# EAGLE design Smart-home (EAGLE 8.6.1)
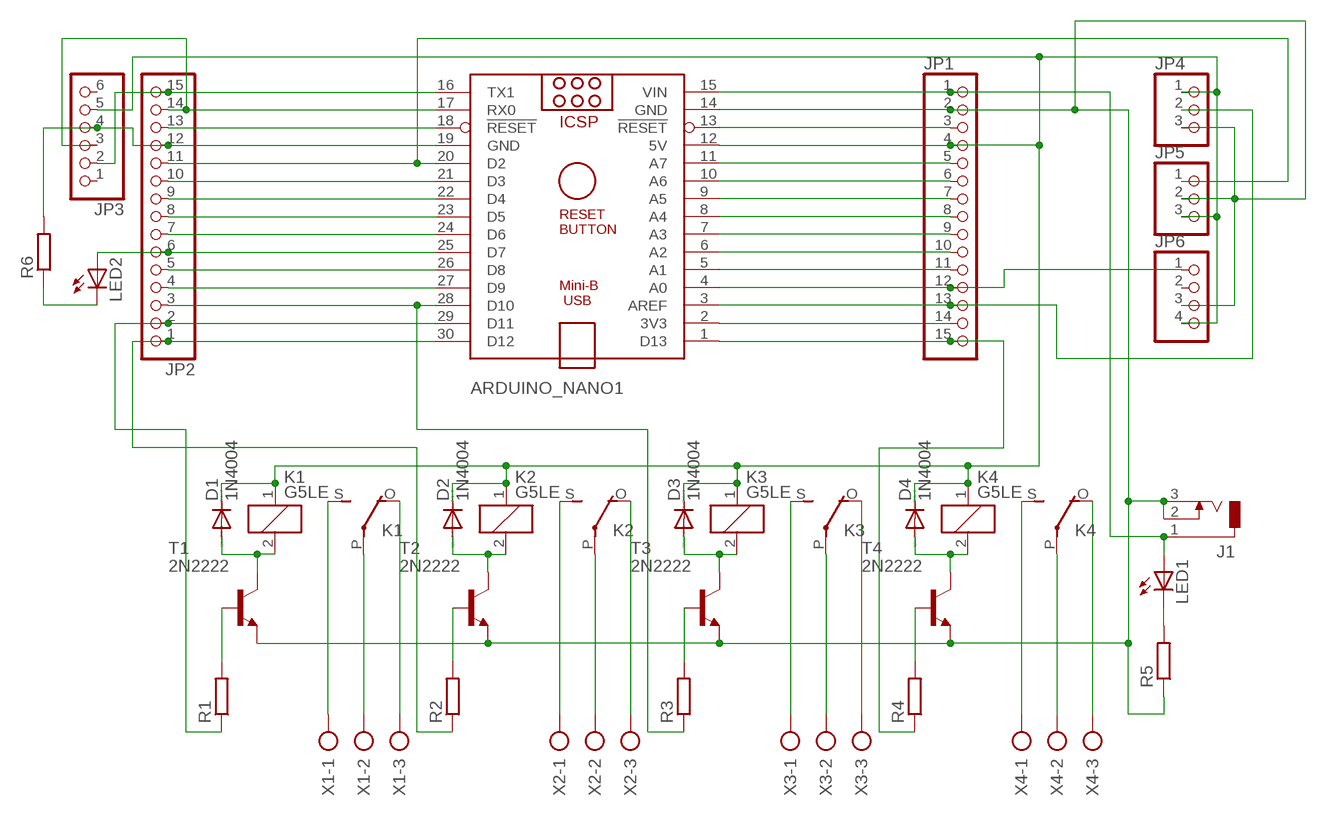
[diagram p0: schematic, sheet 1]

## Parts
ARDUINO_NANO1  ARDUINO_NANO  [ARDUINO_NANO]
D1  1N4004  [DO41-10]
D2  1N4004  [DO41-10]
D3  1N4004  [DO41-10]
D4  1N4004  [DO41-10]
J1  DCJ0303  [DCJ0303]
JP1  PINHD-1X15  [1X15]
JP2  PINHD-1X15  [1X15]
JP3  PINHD-1X6  [1X06]
JP4  PINHD-1X3  [1X03]
JP5  PINHD-1X3  [1X03]
JP6  PINHD-1X4  [1X04]
K1  G5LE  [G5LE]
K2  G5LE  [G5LE]
K3  G5LE  [G5LE]
K4  G5LE  [G5LE]
LED1  LED3MM  [LED3MM]
LED2  LED3MM  [LED3MM]
R1  R-EU_0204/7  [0204/7]
R2  R-EU_0204/7  [0204/7]
R3  R-EU_0204/7  [0204/7]
R4  R-EU_0204/7  [0204/7]
R5  R-EU_0204/7  [0204/7]
R6  R-EU_0204/7  [0204/7]
T1  2N2222  [TO18]
T2  2N2222  [TO18]
T3  2N2222  [TO18]
T4  2N2222  [TO18]
X1  AK300/3  [AK300/3]
X2  AK300/3  [AK300/3]
X3  AK300/3  [AK300/3]
X4  AK300/3  [AK300/3]

## Nets
N$1: D1.A K1.2 T1.3(C)
N$2: ARDUINO_NANO1.17(RX0) JP2.14 JP3.3
N$3: D2.A K2.2 T2.3(C)
N$4: D3.A K3.2 T3.3(C)
N$5: D4.A K4.2 T4.3(C)
N$6: ARDUINO_NANO1.30(D12) JP2.1 R2.1
N$7: R1.2 T1.2(B)
N$8: ARDUINO_NANO1.1(D13) JP1.15 R4.1
N$9: ARDUINO_NANO1.28(D10) JP2.3 R3.1
N$10: ARDUINO_NANO1.16(TX1) JP2.15 JP3.2
N$11: ARDUINO_NANO1.14(GND) J1.2 J1.3 JP1.2 JP4.3 JP5.2 JP6.3 R5.1 T1.1(E) T2.1(E) T3.1(E) T4.1(E)
N$12: ARDUINO_NANO1.18(!RESET) JP2.13
N$13: ARDUINO_NANO1.19(GND) JP2.12 JP3.4 R6.2
N$14: ARDUINO_NANO1.20(D2) JP2.11 JP5.1
N$15: ARDUINO_NANO1.21(D3) JP2.10
N$16: ARDUINO_NANO1.22(D4) JP2.9
N$17: ARDUINO_NANO1.23(D5) JP2.8
N$18: ARDUINO_NANO1.24(D6) JP2.7
N$19: ARDUINO_NANO1.25(D7) JP2.6 LED2.A
N$20: ARDUINO_NANO1.26(D8) JP2.5
N$21: ARDUINO_NANO1.27(D9) JP2.4
N$23: ARDUINO_NANO1.3(AREF) JP1.13 JP4.2
N$24: ARDUINO_NANO1.11(A7) JP1.5
N$25: ARDUINO_NANO1.5(A1) JP1.11
N$26: ARDUINO_NANO1.6(A2) JP1.10
N$27: ARDUINO_NANO1.7(A3) JP1.9
N$28: ARDUINO_NANO1.8(A4) JP1.8
N$29: ARDUINO_NANO1.9(A5) JP1.7
N$30: ARDUINO_NANO1.10(A6) JP1.6
N$31: LED2.K(C) R6.1
N$32: K1.O(2:O) X1.3
N$33: ARDUINO_NANO1.13(!RESET) JP1.3
N$34: ARDUINO_NANO1.2(3V3) JP1.14
N$35: ARDUINO_NANO1.4(A0) JP1.12 JP6.1
N$36: K1.P(2:P) X1.2
N$37: ARDUINO_NANO1.12(5V) D1.C D2.C D3.C D4.C JP1.4 JP3.5 JP4.1 JP5.3 JP6.4 K1.1 K2.1 K3.1 K4.1
N$38: K1.S(2:S) X1.1
N$39: K2.S(2:S) X2.1
N$40: K2.P(2:P) X2.2
N$41: K2.O(2:O) X2.3
N$42: K3.P(2:P) X3.2
N$43: K3.O(2:O) X3.3
N$44: K3.S(2:S) X3.1
N$45: K4.S(2:S) X4.1
N$46: K4.P(2:P) X4.2
N$47: K4.O(2:O) X4.3
N$48: ARDUINO_NANO1.29(D11) JP2.2 R1.1
N$49: R2.2 T2.2(B)
N$50: R3.2 T3.2(B)
N$51: R4.2 T4.2(B)
N$52: ARDUINO_NANO1.15(VIN) J1.1 JP1.1 LED1.A
N$54: LED1.K(C) R5.2
Unconnected: JP3.1 JP3.6 JP6.2

## Library data of the parts
ARDUINO_NANO1 = ArduinoNanoV30:ARDUINO_NANO: Arduino Nano V3.0 Overview: The Arduino Nano is a small, complete, and breadboard-friendly board based on the ATmega328 (Arduino Nano 3.x) or ATmega168 (Arduino Nano 2.x). It has more or less the same functionality of the Arduino Duemilanove, but in a different package. It lacks only a DC power jack, and works with a Mini-B USB cable instead of a standard one. The Nano was designed and is being produced by Gravitech. Specifications: Microcontroller Atmel ATmega168 or ATmega328 Operating Voltage (logic level) 5 V Input Voltage (recommended) 7-12 V Input Voltage (limits) 6-20 V Digital I/O Pins 14 (of which 6 provide PWM output) Analog Input Pins 8 DC Current per I/O Pin 40 mA Flash Memory 16 KB (ATmega168) or 32 KB (ATmega328) of which 2 KB used by bootloader SRAM 1 KB (ATmega168) or 2 KB (ATmega328) EEPROM 512 bytes (ATmega168) or 1 KB (ATmega328) Clock Speed 16 MHz Dimensions 0.73" x 1.70" Length 45 mm Width 18 mm Weigth 5 g Power: The Arduino Nano can be powered via the Mini-B USB connection, 6-20V unregulated external power supply (pin 30), or 5V regulated external power supply (pin 27). The power source is automatically selected to the highest voltage source. Memory: The ATmega168 has 16 KB of flash memory for storing code (of which 2 KB is used for the bootloader); the ATmega328 has 32 KB, (also with 2 KB used for the bootloader). The ATmega168 has 1 KB of SRAM and 512 bytes of EEPROM (which can be read and written with the EEPROM library); the ATmega328 has 2 KB of SRAM and 1 KB of EEPROM. Input and Output: Each of the 14 digital pins on the Nano can be used as an input or output, using pinMode(), digitalWrite(), and digitalRead() functions. They operate at 5 volts. Each pin can provide or receive a maximum of 40 mA and has an internal pull-up resistor (disconnected by default) of 20-50 kOhms. In addition, some pins have specialized functions. Visit Arduino - ArduinoBoardNano <https://www.arduino.cc/en/Main/ArduinoBoardNano>
D1-D4 = diode:1N4004: DIODE general purpose rectifier, 1 A
J1 = con-jack:DCJ0303: DC POWER JACK Source: DCJ0303.pdf; OC_FARNELL: unknown; OC_NEWARK: unknown
JP1 JP2 = pinhead:PINHD-1X15: PIN HEADER
JP3 = pinhead:PINHD-1X6: PIN HEADER
JP4 JP5 = pinhead:PINHD-1X3: PIN HEADER
JP6 = pinhead:PINHD-1X4: PIN HEADER
K1-K4 = relay:G5LE: RELAY 1 x switch, 10 A/120 V AC, 8 A/30 V DC, Omron; OC_FARNELL: unknown; OC_NEWARK: unknown
LED1 LED2 = led:LED: LED OSRAM: - CHIPLED LG R971, LG N971, LY N971, LG Q971, LY Q971, LO R971, LY R971 LH N974, LH R974 LS Q976, LO Q976, LY Q976 LO Q996 - Hyper CHIPLED LW Q18S LB Q993, LB Q99A, LB R99A - SideLED LS A670, LO A670, LY A670, LG A670, LP A670 LB A673, LV A673, LT A673, LW A673 LH A674 LY A675 LS A676, LA A676, LO A676, LY A676, LW A676 LS A679, LY A679, LG A679 - Hyper Micro SIDELED® LS Y876, LA Y876, LO Y876, LY Y876 LT Y87S - SmartLED LW L88C, LW L88S LB L89C, LB L89S, LG L890 LS L89K, LO L89K, LY L89K LS L896, LA L896, LO L896, LY L896 - TOPLED LS T670, LO T670, LY T670, LG T670, LP T670 LSG T670, LSP T670, LSY T670, LOP T670, LYG T670 LG T671, LOG T671, LSG T671 LB T673, LV T673, LT T673, LW T673 LH T674 LS T676, LA T676, LO T676, LY T676, LB T676, LH T676, LSB T676, LW T676 LB T67C, LV T67C, LT T67C, LS T67K, LO T67K, LY T67K, LW E67C LS E67B, LA E67B, LO E67B, LY E67B, LB E67C, LV E67C, LT E67C LW T67C LS T679, LY T679, LG T679 LS T770, LO T770, LY T770, LG T770, LP T770 LB T773, LV T773, LT T773, LW T773 LH T774 LS E675, LA E675, LY E675, LS T675 LS T776, LA T776, LO T776, LY T776, LB T776 LHGB T686 LT T68C, LB T68C - Hyper Mini TOPLED® LB M676 - Mini TOPLED Santana® LG M470 LS M47K, LO M47K, LY M47K Source: http://www.osram.convergy.de LUXEON: - LUMILED® LXK2-PW12-R00, LXK2-PW12-S00, LXK2-PW14-U00, LXK2-PW14-V00 LXK2-PM12-R00, LXK2-PM12-S00, LXK2-PM14-U00 LXK2-PE12-Q00, LXK2-PE12-R00, LXK2-PE12-S00, LXK2-PE14-T00, LXK2-PE14-U00 LXK2-PB12-K00, LXK2-PB12-L00, LXK2-PB12-M00, LXK2-PB14-N00, LXK2-PB14-P00, LXK2-PB14-Q00 LXK2-PR12-L00, LXK2-PR12-M00, LXK2-PR14-Q00, LXK2-PR14-R00 LXK2-PD12-Q00, LXK2-PD12-R00, LXK2-PD12-S00 LXK2-PH12-R00, LXK2-PH12-S00 LXK2-PL12-P00, LXK2-PL12-Q00, LXK2-PL12-R00 Source: www.luxeon.com KINGBRIGHT: KA-3528ASYC Source: www.kingbright.com
R1-R6 = rcl:R-EU_: RESISTOR, European symbol; SPICEPREFIX: R
T1-T4 = transistor:2N2222: NPN TRANSISTOR
X1-X4 = con-ptr500:AK300/3: CONNECTOR; OC_FARNELL: unknown; OC_NEWARK: unknown

## Board
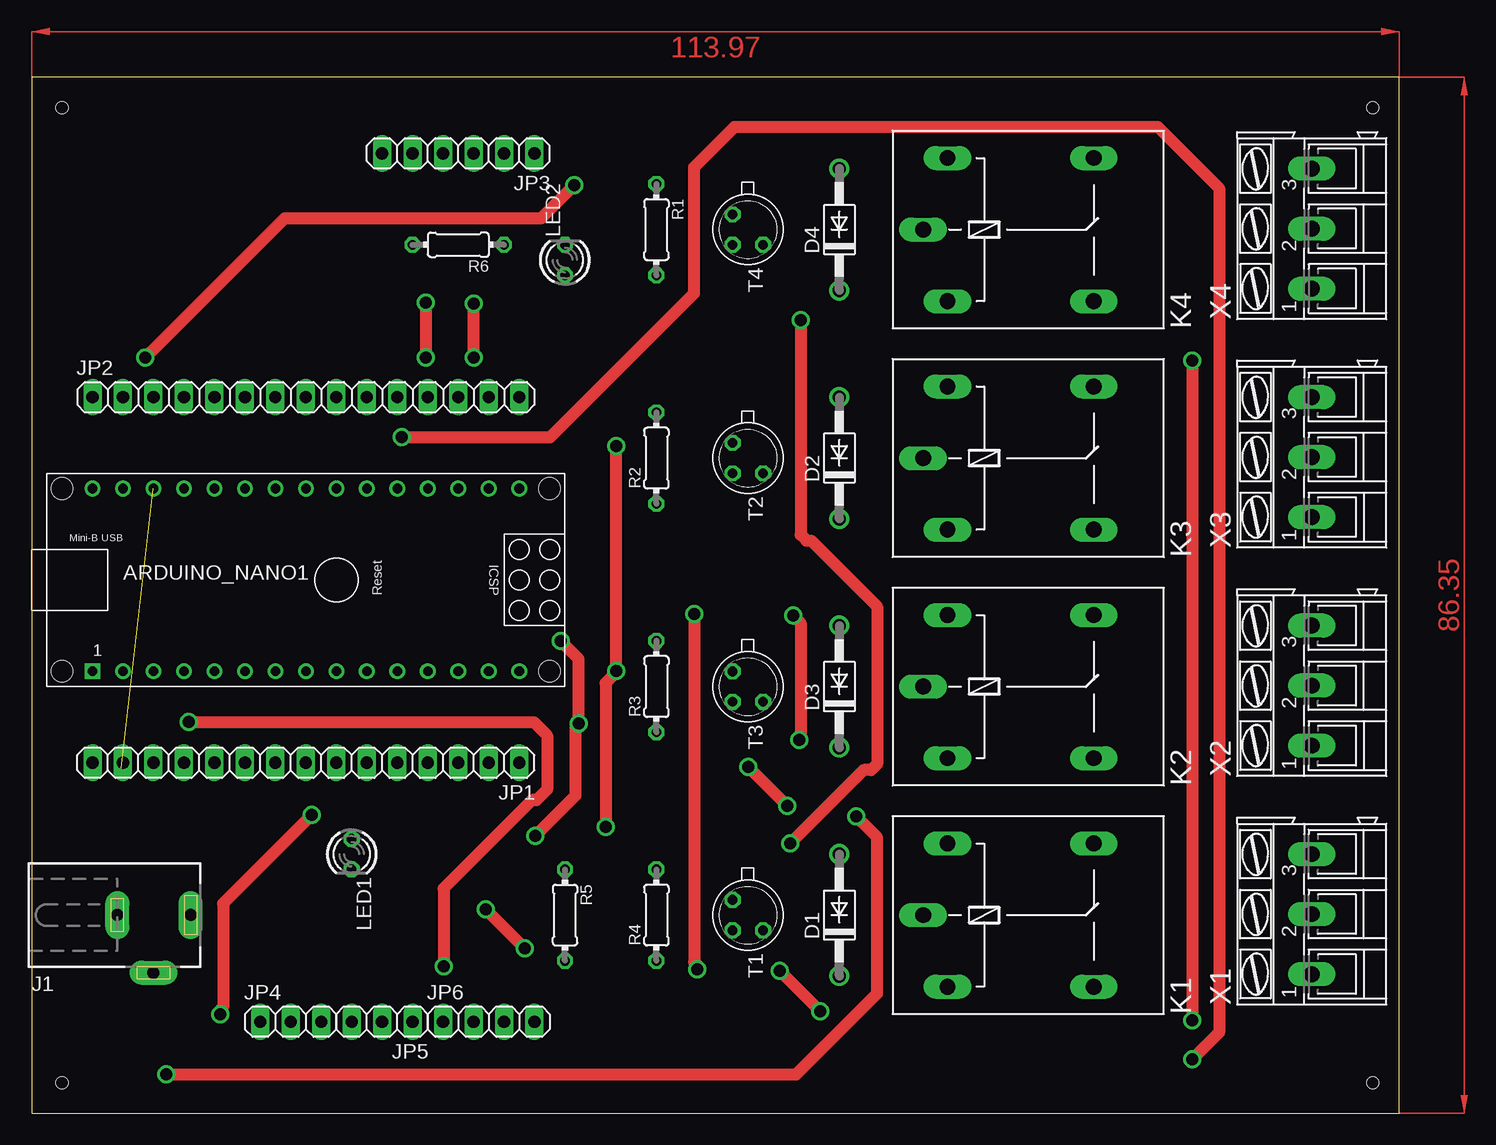
[diagram p1: board, top side]
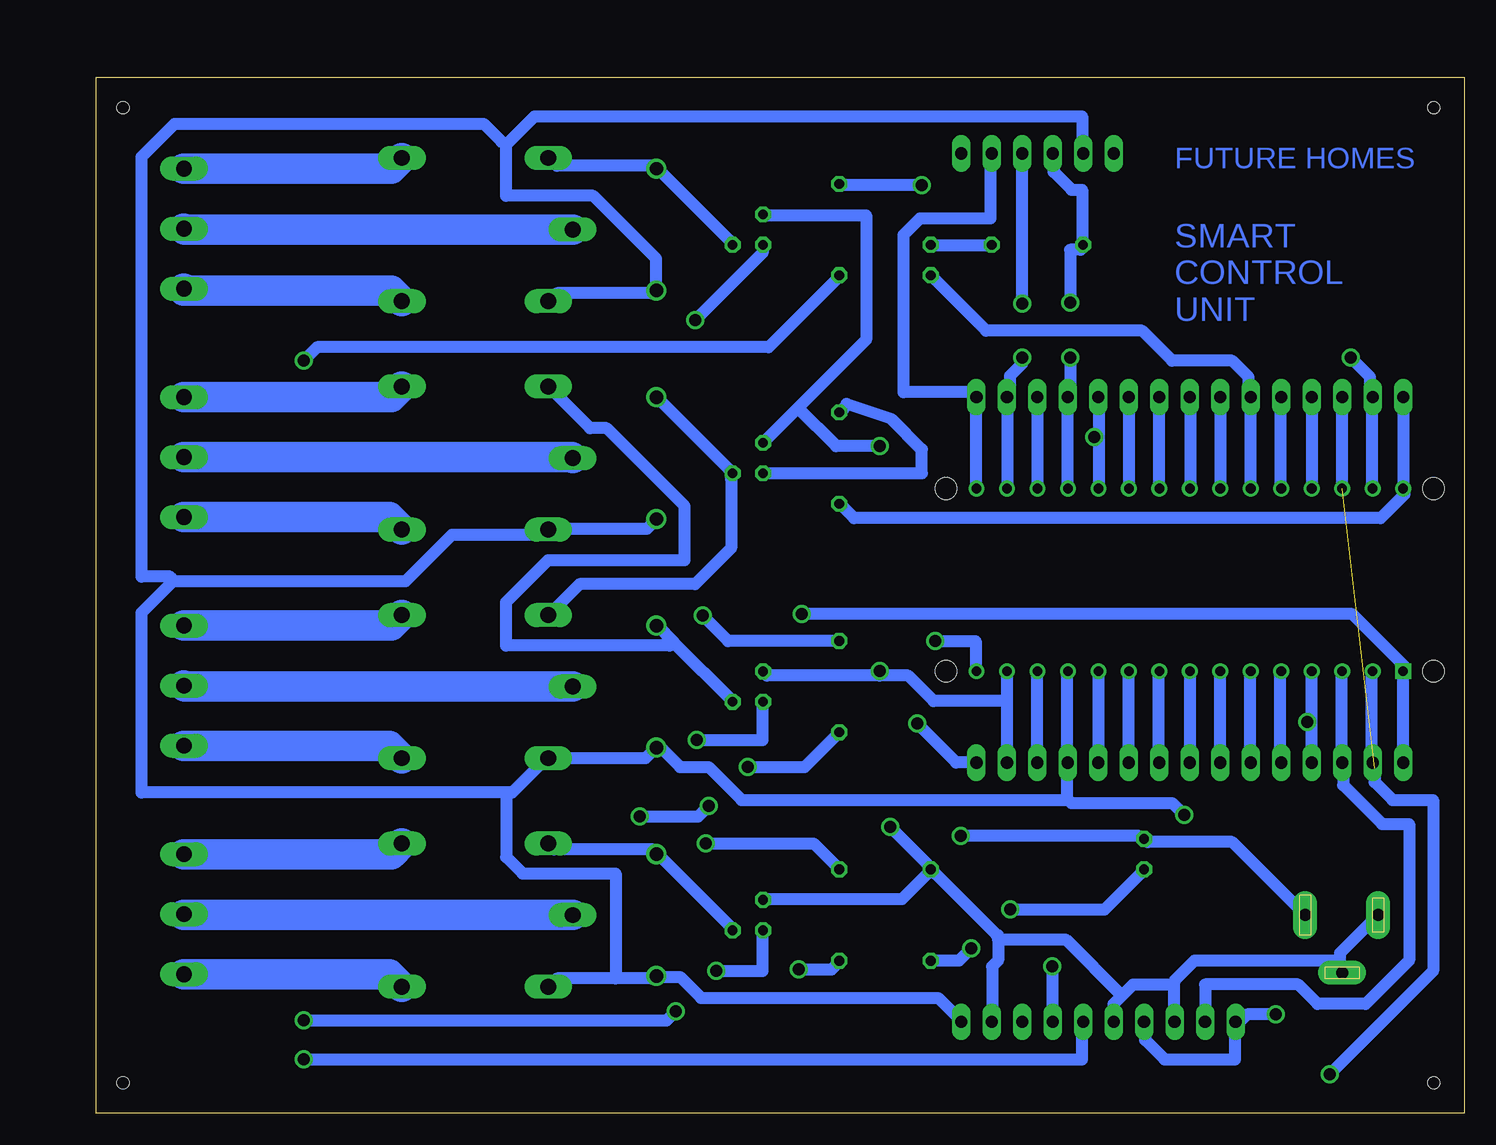
[diagram p2: board, bottom side, seen from below]

Size 113.97 x 86.35 mm. Coordinates in mm from the lower left corner, seen from the top.
Outline: 0,0 113.97,0 113.97,86.35 0,86.35 0,0
Copper layers (1*16): Top 0.035mm / dielectric 1.5mm / Bottom 0.035mm
Design rules "default *": minimum track width 1mm, minimum drill 1mm, track to track 1mm, track to pad 1mm, pad to pad 1mm, via to via 1mm, smd to smd 1mm, copper to edge 40mil, drill to drill 15mil, minimum pad ring 10mil, minimum via ring 8mil, stop-mask expansion 4mil, vias tented up to drill 0mil, thermal gap 10mil
Holes 1 mm at 2.54,2.54 111.76,2.54 111.76,83.82 2.54,83.82
tRestrict: area 26.7,77.5 to 44.5,82.5; area 16.5,3.8 to 44.5,11.4; area 5.1,8.9 to 15.2,22.9; area 24.1,17.8 to 29.2,25.4; area 41.9,11.4 to 54.6,21.6; area 55.9,12.7 to 63.5,21.6; area 64.8,10.2 to 69.8,22.9; area 71.1,8.9 to 94,24.1; area 71.1,27.9 to 94,43.2; area 71.1,47 to 94,62.2; area 71.1,66 to 94,81.3; area 100.3,66 to 113,81.3; 18 more areas

### Footprints (pad centres in the part's own frame; a part is rotated, then mirrored left to right if it is on the bottom)
ARDUINO_NANO = drill 0.8 square: 1 -20.32,-7.62 | drill 0.8: 2 -17.78,-7.62; 3 -15.24,-7.62; 4 -12.7,-7.62; 5 -10.16,-7.62; 6 -7.62,-7.62; 7 -5.08,-7.62; 8 -2.54,-7.62; 9 0,-7.62; 10 2.54,-7.62; 11 5.08,-7.62; 12 7.62,-7.62; 13 10.16,-7.62; 14 12.7,-7.62; 15 15.24,-7.62; 16 15.24,7.62; 17 12.7,7.62; 18 10.16,7.62; 19 7.62,7.62; 20 5.08,7.62; 21 2.54,7.62; 22 0,7.62; 23 -2.54,7.62; 24 -5.08,7.62; 25 -7.62,7.62; 26 -10.16,7.62; 27 -12.7,7.62; 28 -15.24,7.62; 29 -17.78,7.62; 30 -20.32,7.62 | hole 1.778: -22.86,-7.62; -22.86,7.62; 17.78,7.62; 17.78,-7.62
DO41-10 = drill 1.118: A 5.08,0; C -5.08,0
DCJ0303 = drill 1 pad 2 long: 1 0,3.1; 2 4.8,0; 3 0,-3
1X15 = drill 1.016 long: 1 -17.78,0; 2 -15.24,0; 3 -12.7,0; 4 -10.16,0; 5 -7.62,0; 6 -5.08,0; 7 -2.54,0; 8 0,0; 9 2.54,0; 10 5.08,0; 11 7.62,0; 12 10.16,0; 13 12.7,0; 14 15.24,0; 15 17.78,0
1X06 = drill 1.016 long: 1 -6.35,0; 2 -3.81,0; 3 -1.27,0; 4 1.27,0; 5 3.81,0; 6 6.35,0
1X03 = drill 1.016 long: 1 -2.54,0; 2 0,0; 3 2.54,0
1X04 = drill 1.016 long: 1 -3.81,0; 2 -1.27,0; 3 1.27,0; 4 3.81,0
G5LE = drill 1.321 long: 1 -7.493,-5.969; 2 -7.493,5.969; O 4.699,5.969; P -9.525,0; S 4.699,-5.969
LED3MM = drill 0.813 octagon: A -1.27,0; K 1.27,0
0204/7 = drill 0.813 octagon: 1 -3.81,0; 2 3.81,0
TO18 = drill 0.813 octagon: 1 -1.27,-1.27; 2 1.27,-1.27; 3 1.27,1.27
AK300/3 = drill 1.321 long: 1 -5.004,0; 2 0,0; 3 5.004,0

### Placement (x,y rotation side)
ARDUINO_NANO1  25.4,44.45 0 top
D1  67.31,16.51 90 top
D2  67.31,54.61 90 top
D3  67.31,35.56 90 top
D4  67.31,73.66 90 top
J1  10.16,16.51 270 top
JP1  22.86,29.21 180 top
JP2  22.86,59.69 0 top
JP3  35.56,80.01 180 top
JP4  21.59,7.62 0 top
JP5  29.21,7.62 180 top
JP6  38.1,7.62 0 top
K1  83.82,16.51 0 top
K2  83.82,35.56 0 top
K3  83.82,54.61 0 top
K4  83.82,73.66 0 top
LED1  26.67,21.59 270 top
LED2  44.45,71.12 90 top
R1  52.07,73.66 270 top
R2  52.07,54.61 90 top
R3  52.07,35.56 90 top
R4  52.07,16.51 90 top
R5  44.45,16.51 270 top
R6  35.56,72.39 180 top
T1  59.69,16.51 270 top
T2  59.69,54.61 270 top
T3  59.69,35.56 270 top
T4  59.69,73.66 270 top
X1  106.68,16.59 90 top
X2  106.68,35.64 90 top
X3  106.68,54.69 90 top
X4  106.68,73.74 90 top

### Tracks (layer width: path | path; a pad name or v marks a point on that pad's centre or on a via)
N$1
  Bottom 1: T1.3 60.96,15.36 67.08,21.48 67.21,21.48 D1.A 67.58,21.98 75.83,21.98 76.21,22.36 K1.2
N$2  (via drill 1)
  Top 1: v36.84,62.98 v36.84,67.48
  Bottom 1: ARDUINO_NANO1.17 38.09,52.1 38.09,59.6 JP2.14 37.84,60.1 37.84,61.48 36.84,62.48 v36.84,62.98 | v36.84,67.48 36.84,79.98 JP3.3
N$3
  Bottom 1: D2.A 67.21,59.6 60.96,53.35 T2.3 61.09,52.85 61.09,47.1 64.08,44.1 73.71,44.1 76.21,41.6 K2.2
N$4
  Bottom 1: 65.9,39.29 67.21,40.6 D3.A | 65.9,39.29 60.96,34.35 T3.3 | K3.2 76.21,60.48 72.83,57.1 71.46,57.1 64.96,50.6 64.96,46.1 76.33,46.1 79.83,42.6 79.83,38.98 66.21,38.98 65.9,39.29
N$5
  Bottom 1: T4.3 60.96,72.48 67.21,78.73 D4.A 67.71,78.98 75.58,78.98 76.21,79.61 K4.2
N$6
  Bottom 1: JP2.1 5.08,59.6 5.08,52.1 ARDUINO_NANO1.30 4.96,51.6 6.96,49.6 50.84,49.6 51.96,50.73 R2.1
N$7  (via drill 1)
  Top 1: v65.71,8.48 v62.34,11.86 | v96.71,62.73 v96.71,7.73
  Bottom 1: v62.34,11.86 58.46,11.86 58.46,15.23 T1.2 | v65.71,8.48 66.46,7.73 v96.71,7.73 | v96.71,62.73 95.58,63.85 57.96,63.85 52.09,69.73 R1.2
N$8  (via drill 1)
  Top 1: v55.46,11.98 55.46,12.36 55.21,12.61 v55.21,41.6
  Bottom 1: JP1.15 5.08,29.23 5.08,36.73 ARDUINO_NANO1.1 4.96,37.23 9.34,41.6 v55.21,41.6 | v55.46,11.98 52.71,11.98 52.09,12.61 R4.1
N$9  (via drill 1)  (1 unrouted)
  Top 1: v62.96,25.61 v59.71,28.86 | v68.71,24.73 70.46,22.98 70.46,9.98 63.71,3.23 v11.21,3.23
  Bottom 1: v59.71,28.86 54.96,28.86 52.09,31.73 R3.1 | v62.96,25.61 63.84,24.73 v68.71,24.73 | v11.21,3.23 2.58,11.86 2.58,26.11 5.96,26.11 7.46,27.61 7.46,28.73 | ARDUINO_NANO1.28 10.21,52.1 10.21,59.6 JP2.3
N$10
  Bottom 1: ARDUINO_NANO1.16 40.71,52.1 40.71,59.6 JP2.15 40.84,60.1 46.71,60.1 46.71,73.23 45.34,74.61 39.46,74.61 39.46,79.98 JP3.2
N$11  (via drill 1)
  Top 1: v48.71,55.6 v48.71,36.85 48.46,36.48 47.84,35.85 v47.84,23.86
  Bottom 1: 10.34,12.73 10.34,11.73 10.21,11.73 J1.2 | 10.34,12.73 10.34,13.36 7.21,16.48 J1.3 | 24.21,10.73 24.21,7.73 JP4.3 | 24.21,10.73 27.59,10.73 28.52,9.79 | 28.52,9.79 29.21,9.11 JP5.2 | R5.1 44.46,20.23 46.84,17.86 58.34,17.86 T1.1 | 38.84,14.48 38.84,14.86 38.96,14.86 44.09,19.98 R5.1 | 38.84,14.48 38.84,12.73 39.34,12.23 39.34,7.73 JP6.3 | 28.52,9.79 33.21,14.48 38.84,14.48 | 10.34,12.73 22.46,12.73 24.09,11.11 24.21,10.73 | 55.52,58.79 49.84,64.48 49.84,74.86 58.34,74.86 T4.1 | 55.52,58.79 58.34,55.98 T2.1 | 38.09,34.35 38.09,29.23 JP1.2 | 38.09,34.35 38.09,36.73 ARDUINO_NANO1.14 | 48.71,36.48 46.34,36.48 44.21,34.35 38.09,34.35 | 48.71,36.48 58.09,36.48 58.34,36.73 T3.1 | 55.52,58.79 52.34,55.6 v48.71,55.6 | v48.71,36.85 48.71,36.48 | v47.84,23.86 44.71,20.73 R5.1
N$12
  Bottom 1: ARDUINO_NANO1.18 35.59,52.1 35.59,59.6 JP2.13
N$13  (via drill 1)
  Top 1: v32.84,67.56 v32.84,62.98
  Bottom 1: ARDUINO_NANO1.19 33.09,52.1 33.09,59.6 JP2.12 32.84,60.1 v32.84,62.98 | JP3.4 34.21,79.98 34.21,78.48 32.71,76.98 31.84,76.98 31.84,72.48 R6.2 31.96,71.98 32.84,71.98 v32.84,67.56
N$14  (via drill 1)
  Top 1: v96.71,4.48 98.96,6.73 98.96,77.11 93.83,82.23 58.59,82.23 55.21,78.86 55.21,68.36 43.21,56.35 v30.84,56.35
  Bottom 1: 30.46,56.35 30.46,59.6 JP2.11 | 30.46,56.35 30.46,52.1 ARDUINO_NANO1.20 | v96.71,4.48 31.84,4.48 31.84,7.61 JP5.1 | v30.84,56.35 30.46,56.35
N$15
  Bottom 1: ARDUINO_NANO1.21 27.96,52.1 27.96,59.6 JP2.10
N$16
  Bottom 1: ARDUINO_NANO1.22 25.46,52.1 25.46,59.6 JP2.9
N$17
  Bottom 1: ARDUINO_NANO1.23 22.84,52.1 22.84,59.6 JP2.8
N$18
  Bottom 1: ARDUINO_NANO1.24 20.34,52.1 20.34,59.6 JP2.7
N$19
  Bottom 1: ARDUINO_NANO1.25 17.84,52.1 17.84,59.6 JP2.6 17.96,60.1 17.96,61.35 19.34,62.73 24.34,62.73 26.84,65.23 39.84,65.23 44.34,69.73 LED2.A
N$20
  Bottom 1: ARDUINO_NANO1.26 15.34,52.1 15.34,59.6 JP2.5
N$21
  Bottom 1: ARDUINO_NANO1.27 12.71,52.1 12.71,59.6 JP2.4
N$23
  Bottom 1: ARDUINO_NANO1.3 10.21,36.73 10.21,29.23 JP1.13 10.09,28.73 10.09,27.36 6.83,24.11 4.58,24.11 4.58,12.73 8.21,9.11 12.21,9.11 13.84,10.73 21.59,10.73 21.59,7.73 JP4.2
N$24
  Bottom 1: ARDUINO_NANO1.11 30.46,36.73 30.46,29.23 JP1.5
N$25
  Bottom 1: ARDUINO_NANO1.5 15.34,36.73 15.34,29.23 JP1.11
N$26
  Bottom 1: ARDUINO_NANO1.6 17.84,36.73 17.84,29.23 JP1.10
N$27
  Bottom 1: ARDUINO_NANO1.7 20.34,36.73 20.34,29.23 JP1.9
N$28
  Bottom 1: ARDUINO_NANO1.8 22.84,36.73 22.84,29.23 JP1.8
N$29
  Bottom 1: ARDUINO_NANO1.9 25.46,36.73 25.46,29.23 JP1.7
N$30
  Bottom 1: ARDUINO_NANO1.10 27.96,36.73 27.96,29.23 JP1.6
N$31
  Bottom 1: R6.1 39.46,72.36 44.34,72.36 LED2.K
N$32
  Bottom 2.54: K1.O 89.41,21.59 X1.3
N$33
  Bottom 1: ARDUINO_NANO1.13 35.59,36.73 35.59,29.23 JP1.3
N$34
  Bottom 1: ARDUINO_NANO1.2 7.71,36.73 7.71,29.23 JP1.14
N$35  (via drill 1)
  Top 1: v34.34,12.23 34.34,18.73 41.71,26.11 42.09,26.11 42.96,26.98 42.96,31.48 41.84,32.6 v13.09,32.6
  Bottom 1: 12.71,32.6 12.71,29.23 JP1.12 | 12.71,32.6 12.71,36.73 ARDUINO_NANO1.4 | v34.34,12.23 34.34,7.73 JP6.1 | v13.09,32.6 12.71,32.6
N$36
  Bottom 1: X1.2 106.71,16.61 106.68,16.51
  Bottom 2.54: K1.P 106.68,16.51
N$37  (via drill 1)
  Top 1: v15.71,8.23 15.71,8.61 15.96,8.86 15.96,17.48 v23.34,24.86
  Bottom 1: 79.83,80.73 77.46,83.11 31.84,83.11 31.84,80.11 JP3.5 | 79.83,80.73 79.83,76.48 72.58,76.48 67.33,71.23 67.33,68.61 D4.C 67.71,68.36 75.58,68.36 76.21,67.73 K4.1 | JP6.4 41.96,7.73 43.84,9.61 63.59,9.61 65.33,11.36 67.21,11.36 D1.C 67.71,11.23 70.71,11.23 | 70.71,11.23 75.58,11.23 76.21,10.61 K1.1 | D2.C 67.33,49.48 68.08,48.73 76.21,48.73 K3.1 76.83,48.6 77.21,48.23 84.33,48.23 88.21,44.35 107.58,44.35 | JP5.3 26.59,7.61 26.59,6.11 24.96,4.48 19.09,4.48 19.09,7.61 JP4.1 18.59,7.73 18.09,8.23 v15.71,8.23 | ARDUINO_NANO1.12 33.09,36.73 33.09,29.23 JP1.4 33.09,28.73 33.09,26.11 | 33.09,26.11 60.21,26.11 62.96,28.86 65.33,28.86 66.83,30.36 D3.C 67.33,30.48 68.21,29.61 76.21,29.61 K2.1 76.71,29.36 79.33,26.73 79.83,26.73 | v23.34,24.86 24.34,25.86 32.71,25.86 33.09,26.11 | 107.58,44.35 110.21,41.73 110.21,26.73 79.83,26.73 | 70.71,11.23 70.71,19.98 78.46,19.98 79.83,21.36 79.83,26.73 | 79.83,80.73 80.21,80.98 81.71,82.48 107.46,82.48 110.21,79.73 110.21,44.73 107.83,44.73 107.58,44.35
N$38
  Bottom 2.54: K1.S 89.56,11.58 X1.1
N$39
  Bottom 2.54: K2.S 89.56,30.63 X2.1
N$40
  Bottom 2.54: K2.P 106.6,35.56 X2.2
N$41
  Bottom 2.54: K2.O 89.41,40.64 X2.3
N$42
  Bottom 2.54: X3.2 74.37,54.69 K3.P
N$43
  Bottom 2.54: K3.O 89.41,59.69 X3.3
N$44
  Bottom 2.54: K3.S 89.56,49.68 X3.1
N$45
  Bottom 2.54: K4.S 89.41,68.58 106.68,68.58 X4.1
N$46
  Bottom 2.54: K4.P 106.6,73.66 X4.2
N$47
  Bottom 2.54: K4.O 89.41,78.74 X4.3
N$48  (via drill 1)
  Top 1: v45.21,77.36 42.46,74.61 21.09,74.61 v9.46,62.98
  Bottom 1: ARDUINO_NANO1.29 7.71,52.1 7.71,59.6 JP2.2 7.83,60.1 7.83,61.35 v9.46,62.98 | v45.21,77.36 51.96,77.36 R1.1
N$49
  Bottom 1: R2.2 51.96,58.35 51.46,59.12 47.71,57.85 45.19,55.33 45.19,53.35 58.34,53.35 T2.2
N$50  (via drill 1)
  Top 1: v63.96,31.11 63.96,31.48 64.08,31.61 64.08,40.85 v63.46,41.48
  Bottom 1: v63.96,31.11 58.46,31.11 58.46,34.23 T3.2 | v63.46,41.48 61.34,39.35 52.09,39.35 R3.2
N$51  (via drill 1)
  Top 1: v63.21,22.48 69.33,28.61 69.96,28.61 70.46,29.11 70.46,42.23 64.96,47.73 64.58,47.73 64.08,48.23 v64.08,66.11
  Bottom 1: v63.21,22.48 54.21,22.48 52.09,20.36 R4.2 | v64.08,66.11 58.46,71.73 58.46,72.36 T4.2
N$52  (via drill 1)
  Top 1: v44.09,39.35 45.59,37.85 v45.59,32.48 45.34,32.1 45.34,26.48 v41.96,23.11
  Bottom 1: v44.09,39.35 40.71,39.35 40.71,36.85 ARDUINO_NANO1.15 | v45.59,32.48 42.34,29.23 40.71,29.23 JP1.1 | J1.1 13.34,16.61 19.34,22.61 26.34,22.61 26.59,22.86 LED1.A 27.09,23.11 v41.96,23.11
N$54  (via drill 1)
  Top 1: v41.09,13.73 v37.84,16.98
  Bottom 1: v37.84,16.98 29.96,16.98 26.71,20.23 LED1.K | v41.09,13.73 42.09,12.73 44.34,12.73 R5.2
(copper drawn outside any net)
  shapes: Top area x2

### Text on the board
Bottom: FUTURE HOMES | SMART / CONTROL / UNIT